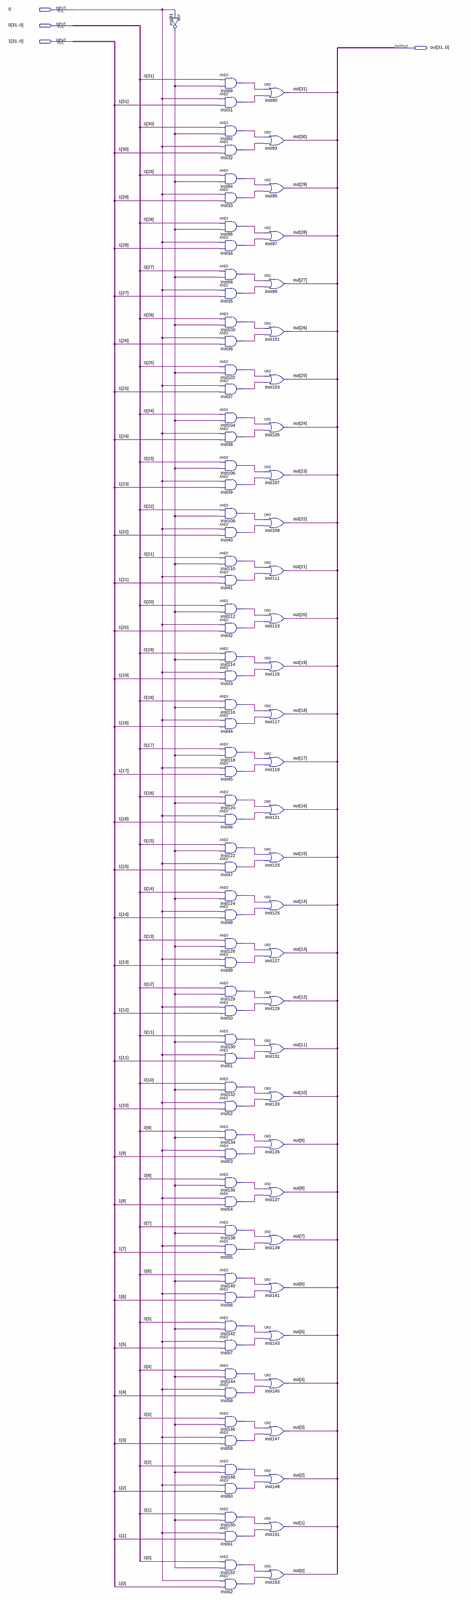
[diagram p0: schematic sheet, whole]
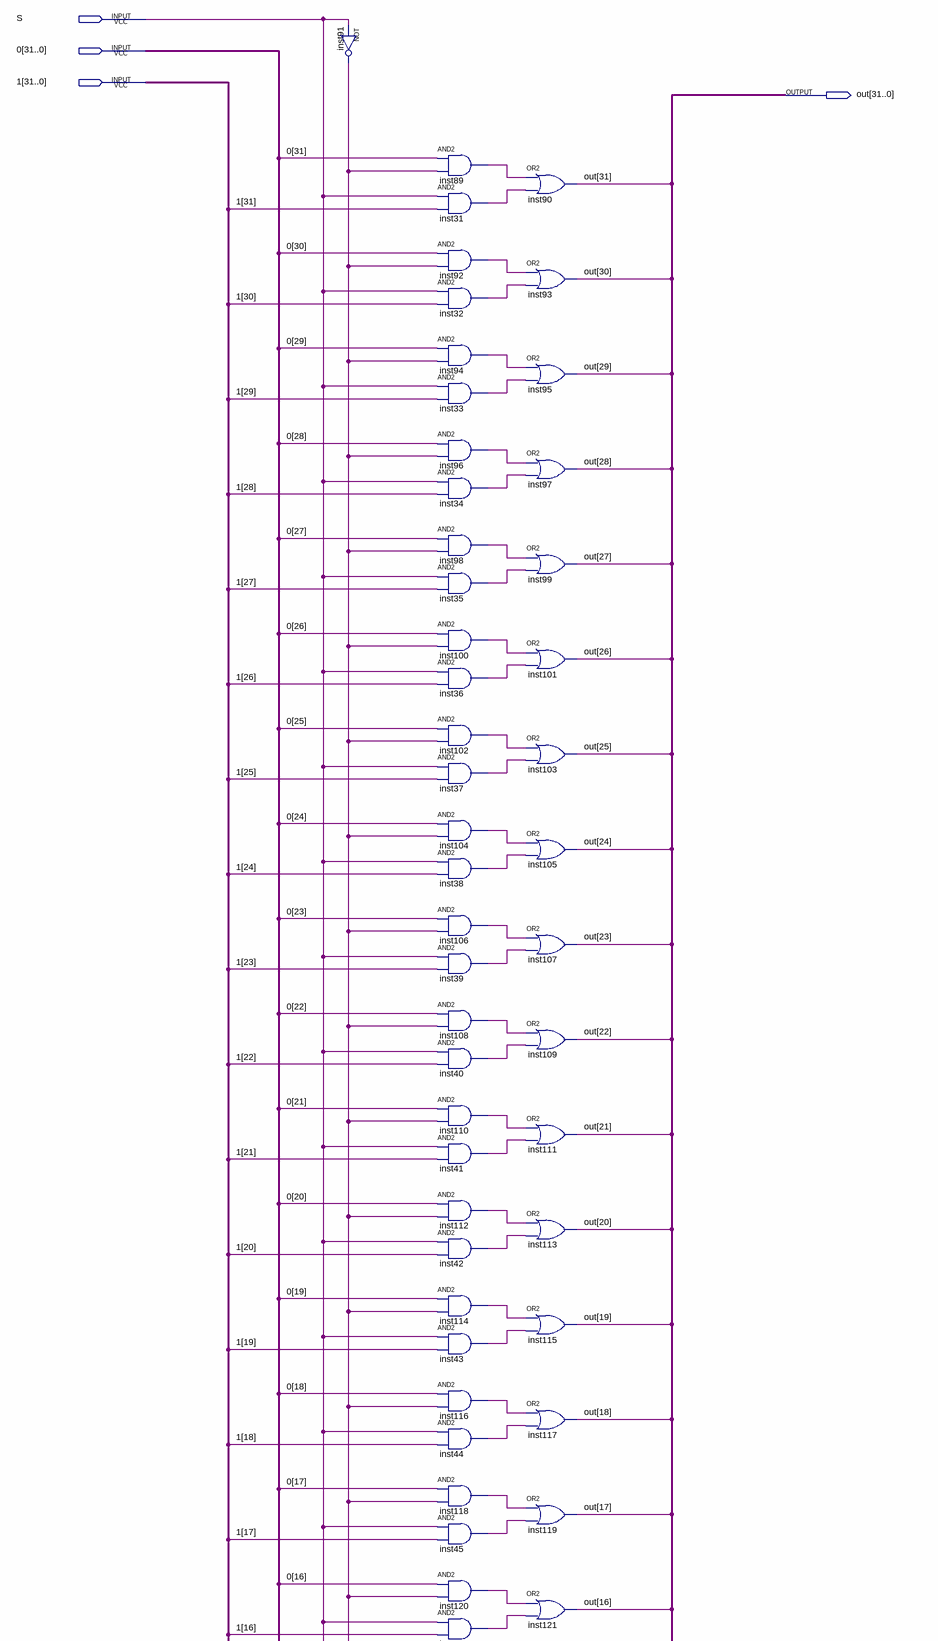
[diagram p1: schematic sheet, upper part]
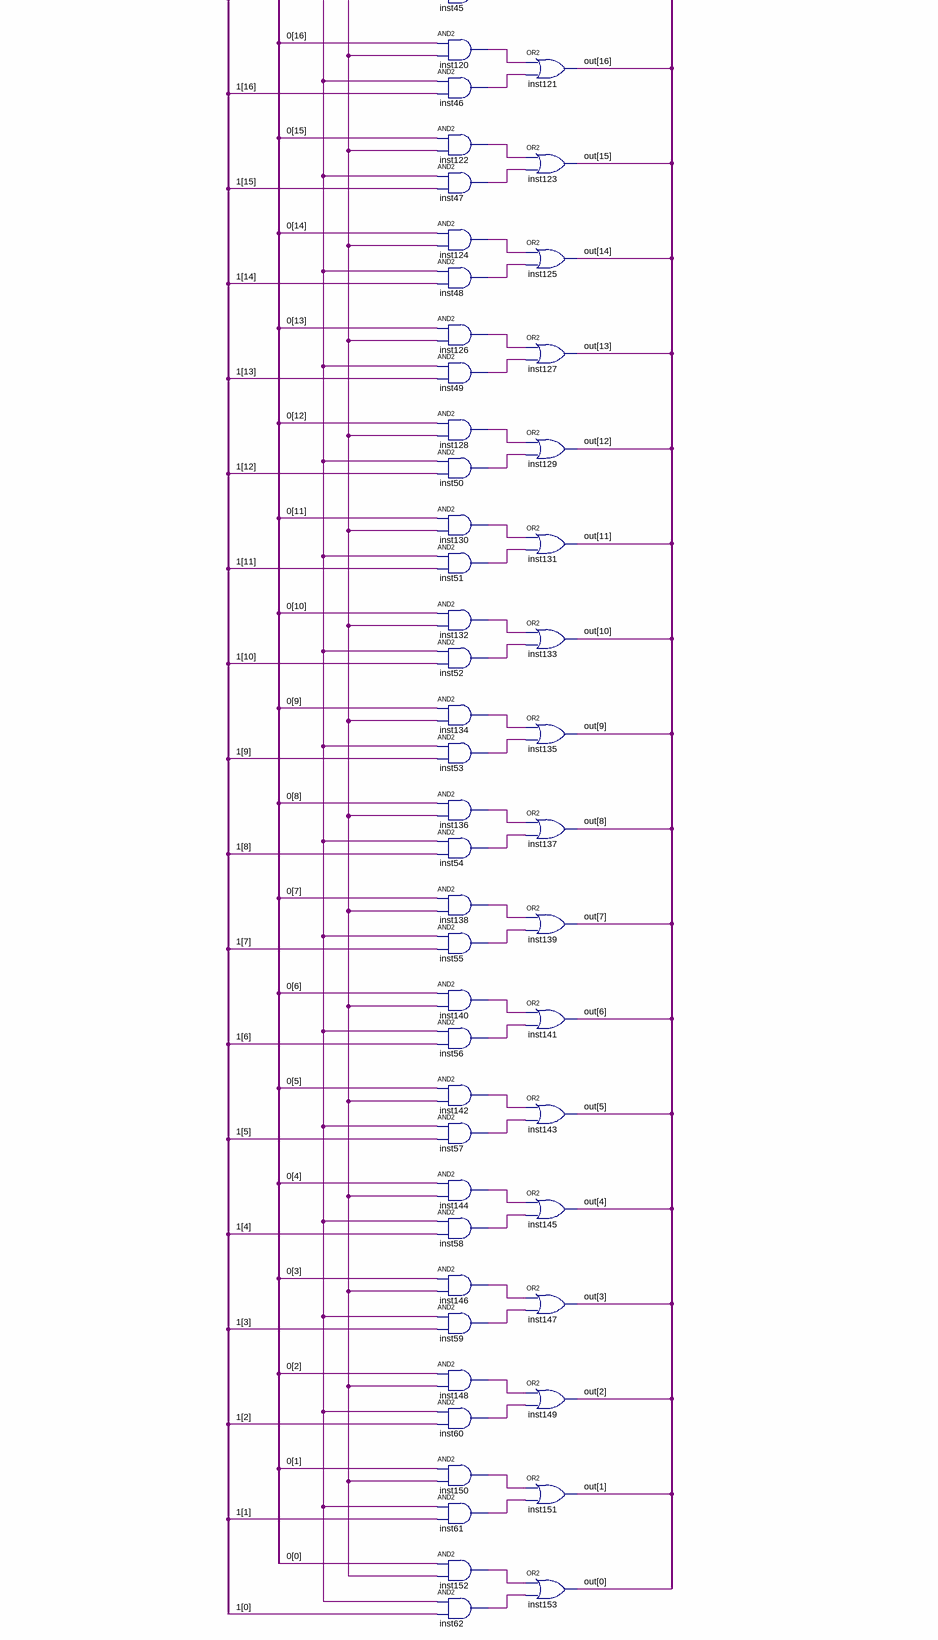
[diagram p2: schematic sheet, lower part]
// Quartus schematic Mux_2.bdf as structural Verilog: 97 symbols, 4 pins
module Mux_2 (
  input  S,
  input  [31:0] \0 ,
  input  [31:0] \1 ,
  output [31:0] out
);

  wire inst31_out, inst32_out, inst33_out, inst34_out, inst35_out, inst36_out, inst37_out, inst38_out,
       inst39_out, inst40_out, inst41_out, inst42_out, inst43_out, inst44_out, inst45_out, inst46_out,
       inst47_out, inst48_out, inst49_out, inst50_out, inst51_out, inst52_out, inst53_out, inst54_out,
       inst55_out, inst56_out, inst57_out, inst58_out, inst59_out, inst60_out, inst61_out, inst62_out,
       inst89_out, inst91_out, inst92_out, inst94_out, inst96_out, inst98_out, inst100_out, inst102_out,
       inst104_out, inst106_out, inst108_out, inst110_out, inst112_out, inst114_out, inst116_out,
       inst118_out, inst120_out, inst122_out, inst124_out, inst126_out, inst128_out, inst130_out,
       inst132_out, inst134_out, inst136_out, inst138_out, inst140_out, inst142_out, inst144_out,
       inst146_out, inst148_out, inst150_out, inst152_out;

  not inst91 (inst91_out, S);
  and inst89 (inst89_out, \0 [31], inst91_out);
  and inst31 (inst31_out, S, \1 [31]);
  and inst92 (inst92_out, \0 [30], inst91_out);
  and inst32 (inst32_out, S, \1 [30]);
  and inst94 (inst94_out, \0 [29], inst91_out);
  and inst33 (inst33_out, S, \1 [29]);
  and inst96 (inst96_out, \0 [28], inst91_out);
  and inst34 (inst34_out, S, \1 [28]);
  and inst98 (inst98_out, \0 [27], inst91_out);
  and inst35 (inst35_out, S, \1 [27]);
  and inst100 (inst100_out, \0 [26], inst91_out);
  and inst36 (inst36_out, S, \1 [26]);
  and inst102 (inst102_out, \0 [25], inst91_out);
  and inst37 (inst37_out, S, \1 [25]);
  and inst104 (inst104_out, \0 [24], inst91_out);
  and inst38 (inst38_out, S, \1 [24]);
  and inst106 (inst106_out, \0 [23], inst91_out);
  and inst39 (inst39_out, S, \1 [23]);
  and inst108 (inst108_out, \0 [22], inst91_out);
  and inst40 (inst40_out, S, \1 [22]);
  and inst110 (inst110_out, \0 [21], inst91_out);
  and inst41 (inst41_out, S, \1 [21]);
  and inst112 (inst112_out, \0 [20], inst91_out);
  and inst42 (inst42_out, S, \1 [20]);
  and inst114 (inst114_out, \0 [19], inst91_out);
  and inst43 (inst43_out, S, \1 [19]);
  and inst116 (inst116_out, \0 [18], inst91_out);
  and inst44 (inst44_out, S, \1 [18]);
  and inst118 (inst118_out, \0 [17], inst91_out);
  and inst45 (inst45_out, S, \1 [17]);
  and inst120 (inst120_out, \0 [16], inst91_out);
  and inst46 (inst46_out, S, \1 [16]);
  and inst122 (inst122_out, \0 [15], inst91_out);
  and inst47 (inst47_out, S, \1 [15]);
  and inst124 (inst124_out, \0 [14], inst91_out);
  and inst48 (inst48_out, S, \1 [14]);
  and inst126 (inst126_out, \0 [13], inst91_out);
  and inst49 (inst49_out, S, \1 [13]);
  and inst128 (inst128_out, \0 [12], inst91_out);
  and inst50 (inst50_out, S, \1 [12]);
  and inst130 (inst130_out, \0 [11], inst91_out);
  and inst51 (inst51_out, S, \1 [11]);
  and inst132 (inst132_out, \0 [10], inst91_out);
  and inst52 (inst52_out, S, \1 [10]);
  and inst134 (inst134_out, \0 [9], inst91_out);
  and inst53 (inst53_out, S, \1 [9]);
  and inst136 (inst136_out, \0 [8], inst91_out);
  and inst54 (inst54_out, S, \1 [8]);
  and inst138 (inst138_out, \0 [7], inst91_out);
  and inst55 (inst55_out, S, \1 [7]);
  and inst140 (inst140_out, \0 [6], inst91_out);
  and inst56 (inst56_out, S, \1 [6]);
  and inst142 (inst142_out, \0 [5], inst91_out);
  and inst57 (inst57_out, S, \1 [5]);
  and inst144 (inst144_out, \0 [4], inst91_out);
  and inst58 (inst58_out, S, \1 [4]);
  and inst146 (inst146_out, \0 [3], inst91_out);
  and inst59 (inst59_out, S, \1 [3]);
  and inst148 (inst148_out, \0 [2], inst91_out);
  and inst60 (inst60_out, S, \1 [2]);
  and inst150 (inst150_out, \0 [1], inst91_out);
  and inst61 (inst61_out, S, \1 [1]);
  and inst152 (inst152_out, \0 [0], inst91_out);
  and inst62 (inst62_out, S, \1 [0]);
  or inst90 (out[31], inst89_out, inst31_out);
  or inst93 (out[30], inst92_out, inst32_out);
  or inst95 (out[29], inst94_out, inst33_out);
  or inst97 (out[28], inst96_out, inst34_out);
  or inst99 (out[27], inst98_out, inst35_out);
  or inst101 (out[26], inst100_out, inst36_out);
  or inst103 (out[25], inst102_out, inst37_out);
  or inst105 (out[24], inst104_out, inst38_out);
  or inst107 (out[23], inst106_out, inst39_out);
  or inst109 (out[22], inst108_out, inst40_out);
  or inst111 (out[21], inst110_out, inst41_out);
  or inst113 (out[20], inst112_out, inst42_out);
  or inst115 (out[19], inst114_out, inst43_out);
  or inst117 (out[18], inst116_out, inst44_out);
  or inst119 (out[17], inst118_out, inst45_out);
  or inst121 (out[16], inst120_out, inst46_out);
  or inst123 (out[15], inst122_out, inst47_out);
  or inst125 (out[14], inst124_out, inst48_out);
  or inst127 (out[13], inst126_out, inst49_out);
  or inst129 (out[12], inst128_out, inst50_out);
  or inst131 (out[11], inst130_out, inst51_out);
  or inst133 (out[10], inst132_out, inst52_out);
  or inst135 (out[9], inst134_out, inst53_out);
  or inst137 (out[8], inst136_out, inst54_out);
  or inst139 (out[7], inst138_out, inst55_out);
  or inst141 (out[6], inst140_out, inst56_out);
  or inst143 (out[5], inst142_out, inst57_out);
  or inst145 (out[4], inst144_out, inst58_out);
  or inst147 (out[3], inst146_out, inst59_out);
  or inst149 (out[2], inst148_out, inst60_out);
  or inst151 (out[1], inst150_out, inst61_out);
  or inst153 (out[0], inst152_out, inst62_out);
endmodule
